# Altium schematic sheet ArduinoZeroV4.0_0.SchDoc: ArduinoZeroV4.0
size 409 x 289 mm; Origin: Eagle; Date: 2023-03-06 22:00:55; SheetNumber: 1; CODE-ARDUINO: DNP; DATASHEET: DNP; DISTRIBUTOR-LINK: DNP; DISTRIBUTOR-PN: DNP; MANUFACTURER: DNP; MANUFACTURER-PN: DNP; NOTE: DNP; Value: DNP; GateName_1: G$1; SymbolName_1: A3L-LOC; LibraryName: Arduino-utility; DeviceSetName: A3-FRAME; Sheet: Sheet:; ReferenceDesignsAREPROVIDED"ASIS"AND"WITHALLFAULTS.ArduinoSADISCLAIMSALLOTHERWARRANTIES,EXPRESSORIMPLIED,
REGARDINGPRODUCTS,INCLUDINGBUTNOTLIMITEDTO,ANYIMPLIEDWARRANTIESOFMERCHANTABILITYORFITNESSFORAPARTICULARPURPOSE

ArduinoSAmaymakechangestospecificationsandproductdescriptionsatanytime,withoutnotice.TheCustomermustnot
relyontheabsenceorcharacteristicsofanyfeaturesorinstructionsmarked"reserved"or"undefined."ArduinoSAreserves
theseforfuturedefinitionandshallhavenoresponsibilitywhatsoeverforconflictsorincompatibilitiesarisingfromfuturechangestothem.
TheproductinformationontheWebSiteorMaterialsissubjecttochangewithoutnotice.Donotfinalizeadesignwiththisinfo

ARDUINOandotherArduinobrandsandlogosandTrademarksofArduinoSA.AllArduinoSATrademarkscannotbeusedwithoutowner'sformalpermission: Reference Designs ARE PROVIDED "AS IS" AND "WITH ALL FAULTS. Arduino SA DISCLAIMS ALL OTHER WARRANTIES, EXPRESS OR IMPLIED, / REGARDING PRODUCTS, INCLUDING BUT NOT LIMITED TO, ANY IMPLIED WARRANTIES OF MERCHANTABILITY OR FITNESS FOR A PARTICULAR PURPOSE / Arduino SA may make changes to specifications and product descriptions at any time, without notice. The Customer must not / rely on the absence or characteristics of any features or instructions marked "reserved" or "undefined." Arduino SA reserves / these for future definition and shall have no responsibility whatsoever for conflicts or incompatibilities arising from future changes to them. / The product information on the Web Site or Materials is subject to change without notice. Do not finalize a design with this info / ARDUINO and other Arduino brands and logos and Trademarks of Arduino SA. All Arduino SA Trademarks cannot be used without owner's formal permission
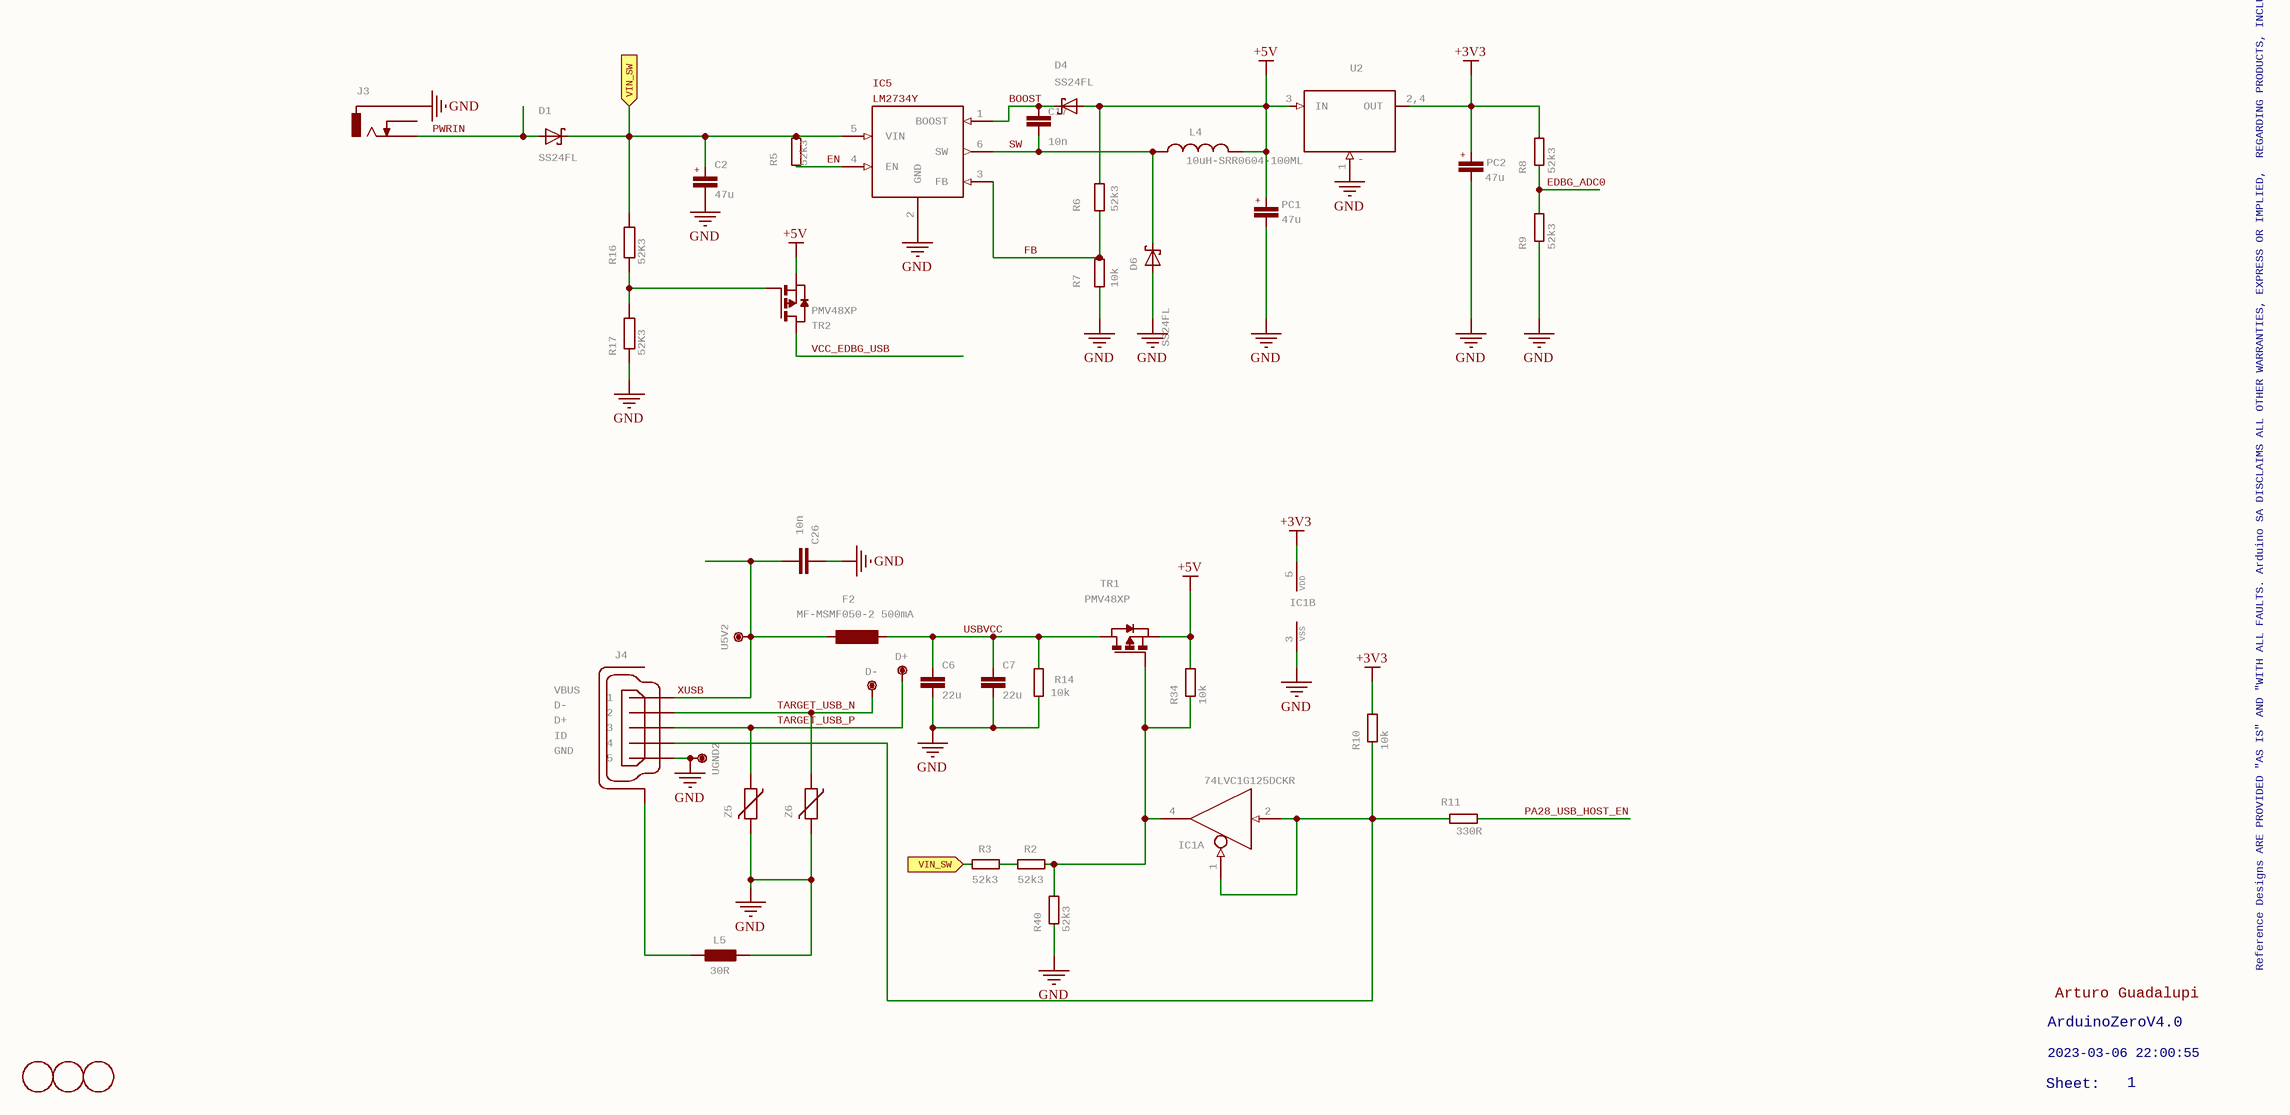
[diagram p0: ArduinoZeroV4.0_0.SchDoc]

## Parts
C2  47u  [PANASONIC_D]
C6  22u  [0805-R2013X50N]
C7  22u  [0805-R2013X50N]
C17  10n  [0603-1608X90N]
C26  10n  [C0603-ROUND]
D1  SS24FL  [SOD123F]
D4  SS24FL  [SOD123F]
D6  SS24FL  [SOD123F]
D+  DNP  [TP-1.00MM]  (value not drawn)
D-  DNP  [TP-1.00MM]  (value not drawn)
F2  MF-MSMF050-2 500mA  [L1812]
FD1  DNP  [FD-1-1.5]  (value not drawn)
FD2  DNP  [FD-1-1.5]  (value not drawn)
FD3  DNP  [FD-1-1.5]  (value not drawn)
IC1  74LVC1G125DCKR  [SC70-5]  (parts A,B of 2)
IC5  LM2734Y  [SOT23-6]
J3  -  [POWERSUPPLY_DC-21MM]  (value not drawn)
J4  -  [ZX62-AB-5PA]  (value not drawn)
L4  10uH-SRR0604-100ML  [SRR0604]
L5  30R  [0805-R2013X50N]
PC1  47u  [PANASONIC_D]
PC2  47u  [PANASONIC_D]
R2  52k3  [C0603]
R3  52k3  [C0603]
R5  52k3  [C0603]
R6  52k3  [C0603]
R7  10k  [C0603]
R8  52k3  [C0603]
R9  52k3  [C0603]
R10  10k  [C0603]
R11  330R  [C0603]
R14  10k  [C0603]
R16  52K3  [R0603-ROUND]
R17  52K3  [R0603-ROUND]
R34  10k  [C0603]
R40  52k3  [C0603]
TR1  PMV48XP  [SOT-23]
TR2  PMV48XP  [SOT-23]
U2  -  [SOT223]
U5V2  DNP  [TP-1.00MM]  (value not drawn)
UGND2  DNP  [TP-1.00MM]  (value not drawn)
Z5  -  [C0603]  (value not drawn)
Z6  -  [C0603]  (value not drawn)

## Ports
VIN_SW (in)

## Nets
+3V3: IC1.5(VDD) PC2.+ R8.2 R10.2 U2.2,4(OUT)
+5V: D4.A L4.P$2 PC1.+ R6.1 R34.2 TR1.2(S) TR2.2(S) U2.3(IN)
GND: C2.- C6.2 C7.2 C26.2 D6.A IC1.3(VSS) IC5.2(GND) J3.-1-3 J4.5 L5.2 PC1.- PC2.- R7.2 R9.1 R14.1 R17.1 R40.1 U2.1(GND/ADJ) UGND2.X(P$1) Z5.2 Z6.2
BOOST: C17.1 D4.C IC5.1(BOOST)
EDBG_ADC0: R8.1 R9.2
EN: IC5.4(EN) R5.2
FB: IC5.3(FB) R6.2 R7.1
PA28_USB_HOST_EN: R11.2
PWRIN: D1.A J3.+1-3
SW: C17.2 D6.C IC5.6(SW) L4.P$1
TARGET_USB_N: D-.X(P$1) J4.2 Z6.1
TARGET_USB_P: D+.X(P$1) J4.3 Z5.1
USBVCC: C6.1 C7.1 F2.1 R14.2 TR1.1(D)
VCC_EDBG_USB: TR2.1(D)
VIN_SW: C2.+ D1.C IC5.5(VIN) R3.1 R5.1 R16.2 ; port VIN_SW
XUSB: C26.1 F2.2 J4.1 U5V2.X(P$1)
NetIC1_1: IC1.1(OE) IC1.2(I) J4.4 R10.1 R11.1
NetIC1_4: IC1.4(O) R2.2 R34.1 R40.2 TR1.3(G)
NetJ4_6-11: J4.6-11(SH) L5.1
NetR2_1: R2.1 R3.2
NetR16_1: R16.1 R17.2 TR2.3(G)

Not connected (* = marked no-connect by the designer): J3 E1-3(2)

## Notes on the sheet
- Reference Designs ARE PROVIDED "AS IS" AND "WITH ALL FAULTS. Arduino SA DISCLAIMS ALL OTHER WARRANTIES, EXPRESS OR IMPLIED,
  REGARDING PRODUCTS, INCLUDING BUT NOT LIMITED TO, ANY IMPLIED WARRANTIES OF MERCHANTABILITY OR FITNESS FOR A PARTICULAR PURPOSE
  Arduino SA may make changes to specifications and product descriptions at any time, without notice. The Customer must not
  rely on the absence or characteristics of any features or instructions marked "reserved" or "undefined." Arduino SA reserves
  these for future definition and shall have no responsibility whatsoever for conflicts or incompatibilities arising from future changes to them.
  The product information on the Web Site or Materials is subject to change without notice. Do not finalize a design with this info
  ARDUINO and other Arduino brands and logos and Trademarks of Arduino SA. All Arduino SA Trademarks cannot be used without owner's formal permission
- ArduinoZeroV4.0
- Arturo Guadalupi
- Sheet:
- 2023-03-06 22:00:55
- 1

## Library data of the parts
C2 PC1 PC2 = C+PAN-D: Polarized Capacitor; MANUFACTURER: Panasonic; MANUFACTURER-PN: EEE-1EA470WP; GateName_1: G$1; SymbolName_1: C+; DeviceName: PAN-D; CODE-ARDUINO: 0113; PN-ALTERNATIVE1: TS13C01E470MET000R; LibraryName: Arduino-rcl; DeviceSetName: C+; +: +; DATASHEET: https://industrial.panasonic.com/cdbs/www-data/pdf/RDE0000/DME0000COL90.pdf; DISTRIBUTOR-LINK: https://www.digikey.com/product-detail/en/panasonic-electronic-components/EEE-1EA470WP/PCE3908CT-ND/766284; DISTRIBUTOR-PN: PCE3908CT-ND
C6 C7 = C-0805: SMD Capacitor; MANUFACTURER: Samsung; MANUFACTURER-PN: CL21A226MQCLQNC; GateName_1: G$1; SymbolName_1: C; DeviceName: -0805; CODE-ARDUINO: 2233; LibraryName: Arduino-rcl; DeviceSetName: C; DATASHEET: https://media.digikey.com/pdf/Data%20Sheets/Samsung%20PDFs/CL21A226MQCLQNC_character.pdf; DISTRIBUTOR-LINK: https://www.digikey.com/product-detail/en/samsung-electro-mechanics-america-inc/CL21A226MQCLQNC/1276-2412-1-ND/3890498; DISTRIBUTOR-PN: 1276-2412-1-ND; NOTE: -
C17 = C-0603: SMD Capacitor; MANUFACTURER: Murata; MANUFACTURER-PN: GRM188R71H103KA01D; GateName_1: G$1; SymbolName_1: C; DeviceName: -0603; CODE-ARDUINO: 0142; LibraryName: Arduino-rcl; DeviceSetName: C; DATASHEET: http://www.murata.com/~/media/webrenewal/support/library/catalog/products/capacitor/mlcc/c02e.pdf; DISTRIBUTOR-LINK: https://www.digikey.com/product-detail/en/murata-electronics-north-america/GRM188R71H103KA01D/490-1512-1-ND/587862; DISTRIBUTOR-PN: 490-1512-1-ND; NOTE: -; PN-ALTERNATIVE1: PN-ALTERNATIVE1; PN-ALTERNATIVE2: PN-ALTERNATIVE2; PN-ALTERNATIVE3: PN-ALTERNATIVE3; PN-ALTERNATIVE4: PN-ALTERNATIVE4; PN-ALTERNATIVE5: PN-ALTERNATIVE5
C26 = 0142_10NF_0603: 10nF 0603; GateName_1: G$1; SymbolName_1: C-EU; MONTHLY_USAGE: _____; TYPE: Condensatori; LibraryName: Condensatori; DeviceSetName: 0142_10NF_0603; CASE: 0603; PART_NUMBER: 10nF_0603; PRICE: _____; SUPPLIER: _____
D1 D4 D6 = SS24FL: Schottky diode; MANUFACTURER: Fairchild; GateName_1: G$1; SymbolName_1: SCHOTTKY-1; CODE-ARDUINO: 0025; LibraryName: Arduino-diodes; DeviceSetName: SS24FL; DATASHEET: https://www.fairchildsemi.com/datasheets/SS/SS24FL.pdf; DISTRIBUTOR-LINK: https://www.digikey.com/product-detail/en/fairchild-on-semiconductor/SS24FL/SS24FLCT-ND/5305093; DISTRIBUTOR-PN: SS24FLCT-ND; MANUFACTURER-PN: SS24FL
D+ D- U5V2 UGND2 = TPTP-1.00MM: Testpoint; GateName_1: G$1; DeviceSetName: TP; SymbolName_1: TESTPOINT; DeviceName: TP-1.00MM; LibraryName: Arduino-utility; CODE-ARDUINO: DNP; DATASHEET: DNP; DISTRIBUTOR-LINK: DNP; DISTRIBUTOR-PN: DNP; MANUFACTURER: DNP; MANUFACTURER-PN: DNP
F2 = 0002_MF-MSMF050-2: 500 mA Multifuse ï¿½ Polyfuse; GateName_1: G$1; SymbolName_1: L-EU; MONTHLY_USAGE: _____; TYPE: Protezione; LibraryName: Protezione; DeviceSetName: 0002_MF-MSMF050-2; CASE: CASE; PART_NUMBER: MF-MSMF050-2; PRICE: _____; SUPPLIER: _____
FD1-FD3 = FIDUCIAL-1.5MM: Fiducial mount; GateName_1: G$1; SymbolName_1: ARDUINO_FIDUCIAL; DeviceName: -1.5MM; LibraryName: Arduino-utility; DeviceSetName: FIDUCIAL; CODE-ARDUINO: DNP; DATASHEET: DNP; DISTRIBUTOR-LINK: DNP; DISTRIBUTOR-PN: DNP; MANUFACTURER: DNP; MANUFACTURER-PN: DNP
IC1 = SN74LVC1G125DCKR: Single bus buffer with 3-state output; MANUFACTURER: Texas Instruments; GateName_1: A; SymbolName_1: 74125; GateName_2: P; SymbolName_2: PWRN-2; CODE-ARDUINO: 0040; NOTE: NO; LibraryName: Arduino-ICs; DeviceSetName: SN74LVC1G125DCKR; DATASHEET: http://www.ti.com/lit/ds/symlink/sn74lvc1g125.pdf; DISTRIBUTOR-LINK: https://www.digikey.com/product-detail/en/texas-instruments/SN74LVC1G125DCKR/296-11604-1-ND/385743; DISTRIBUTOR-PN: 296-11604-1-ND; MANUFACTURER-PN: SN74LVC1G125DCKR
IC5 = 0179_LM2734YMK: 1A Load Step-Down DC-DC Regulator - LM2734Y   Switching; GateName_1: G$1; SymbolName_1: LM2736; MONTHLY_USAGE: _____; LibraryName: Circuito Integrato; DeviceSetName: 0179_LM2734YMK; CASE: SOT23-5; PART_NUMBER: LM2734YMK; PRICE: _____; SUPPLIER: _____; TYPE: Circuito_Integrato
J3 = BARRELLG: Power Barrel Connector Jack 2.10mm ID (0.083"), 5.50mm OD (0.217") Through Hole, Right Angle; MANUFACTURER: Kobiconn; MANUFACTURER-PN: 163-179PH-EX; GateName_1: G$1; SymbolName_1: DC-JACK-SWITCH; DeviceName: LG; CODE-ARDUINO: 0018; LibraryName: Arduino-connectors; DeviceSetName: BARREL; DATASHEET: http://www.mouser.com/ds/2/253/KC-301287-195995.pdf; DISTRIBUTOR-LINK: https://www.mouser.it/ProductDetail/Kobiconn/163-179PH-EX/?qs=Xb8IjHhkxj5l2UOaIqcGCw==; DISTRIBUTOR-PN: 163-179PH-EX
J4 = USB-MICRO: USB - micro AB USB 2.0 Receptacle Connector 5 Position Surface Mount, Right Angle, Horizontal; MANUFACTURER: Hirose; MANUFACTURER-PN: ZX62-AB-5PA(31); GateName_1: G$1; CODE-ARDUINO: 2219; SymbolName_1: USB-MICRO; LibraryName: Arduino-connectors; DeviceSetName: USB-MICRO; VBUS: VBUS; D-: D-; D+: D+; ID: ID; GND: GND; DATASHEET: https://www.hirose.com/product/en/download_file/key_name/ZX/category/Catalog/doc_file_id/31704/?file_category_id=4&item_id=13&is_series=1; DISTRIBUTOR-LINK: http://www.digikey.com/product-detail/en/hirose-electric-co-ltd/ZX62-AB-5PA(31)/H125279CT-ND/5994741; DISTRIBUTOR-PN: H125279CT-ND
L4 = 0031_SRR0604-100ML: SRR0604-100ML; GateName_1: G$1; SymbolName_1: L-US; MONTHLY_USAGE: _____; TYPE: Induttanze; LibraryName: Induttanze; DeviceSetName: 0031_SRR0604-100ML; CASE: SMD_6,5x6,5; PART_NUMBER: SRR0604-100ML; PRICE: _____; SUPPLIER: _____
L5 = FERRITE0805: SMD ferrite; MANUFACTURER: Samsung; MANUFACTURER-PN: CIB21P300NE; GateName_1: >NAME; DeviceName: 0805; CODE-ARDUINO: 0001; SymbolName_1: FERRITE; LibraryName: Arduino-rcl; DeviceSetName: FERRITE; DATASHEET: https://media.digikey.com/pdf/Data%20Sheets/Samsung%20PDFs/Chip_Inductor_Catalog_2014.pdf; DISTRIBUTOR-LINK: https://www.digikey.com/products/en?keywords=CIB21P300NE; DISTRIBUTOR-PN: CIB21P300NE-ND; PN-ALTERNATIVE1: PN-ALTERNATIVE1
R2 R3 R5-R9 R40 = R-0603: SMD Resistor; MANUFACTURER: Yageo; MANUFACTURER-PN: RC0603FR-0752K3L; GateName_1: G$1; SymbolName_1: R; DeviceName: -0603; CODE-ARDUINO: A5459; NOTE: 1% ONLY; LibraryName: Arduino-rcl; DeviceSetName: R; DATASHEET: https://industrial.panasonic.com/cdbs/www-data/pdf/RDA0000/AOA0000C304.pdf; DISTRIBUTOR-LINK: https://www.digikey.com/product-detail/en/yageo/RC0603FR-0752K3L/311-52.3KHRCT-ND/730237; DISTRIBUTOR-PN: 311-52.3KHRCT-ND; PN-ALTERNATIVE1: -
R10 R14 R34 = R-0603: SMD Resistor; MANUFACTURER: Yageo; MANUFACTURER-PN: RC0603JR-0710KL; GateName_1: G$1; SymbolName_1: R; DeviceName: -0603; CODE-ARDUINO: 0028; NOTE: NO; LibraryName: Arduino-rcl; DeviceSetName: R; DATASHEET: http://www.yageo.com/documents/recent/PYu-RC_Group_51_RoHS_L_8.pdf; DISTRIBUTOR-LINK: https://www.digikey.com/product-detail/en/yageo/RC0603JR-0710KL/311-10KGRCT-ND/729647; DISTRIBUTOR-PN: 311-10KGRCT-ND; PN-ALTERNATIVE1: -
R11 = R-0603: SMD Resistor; MANUFACTURER: Yageo; MANUFACTURER-PN: RC0603FR-07330RL; GateName_1: G$1; SymbolName_1: R; DeviceName: -0603; CODE-ARDUINO: 0049; NOTE: NO; LibraryName: Arduino-rcl; DeviceSetName: R; DATASHEET: http://www.yageo.com/documents/recent/PYu-RC_Group_51_RoHS_L_10.pdf; DISTRIBUTOR-LINK: https://www.digikey.com/product-detail/en/yageo/RC0603FR-07330RL/311-330HRCT-ND/730109; DISTRIBUTOR-PN: 311-330HRCT-ND; PN-ALTERNATIVE1: -
R16 R17 = 0180_52K3_0603: 52k3 0603; GateName_1: G$1; SymbolName_1: R-EU; MONTHLY_USAGE: _____; LibraryName: Resistenze; DeviceSetName: 0180_52K3_0603; CASE: 0603; PART_NUMBER: 52k3_0603; PRICE: _____; SUPPLIER: _____; TYPE: Resistenze
TR1 TR2 = PMV48XP: 20 V, 3.5 A P-channel Trench MOSFET - PMV48XP; MANUFACTURER: Nexperia; MANUFACTURER-PN: PMV48XP,215; SymbolName_1: P_MOSFET; CODE-ARDUINO: 1039; PN-ALTERNATIVE: FDN340P; PN-ALTERNATIVE2: IRLML6402TRPBF; GateName_1: A; LibraryName: Arduino-transistors; DeviceSetName: PMV48XP; DATASHEET: https://assets.nexperia.com/documents/data-sheet/PMV48XP.pdf; DISTRIBUTOR-LINK: https://www.digikey.com/product-detail/en/nexperia-usa-inc/PMV48XP215/1727-5907-1-ND/2744665; DISTRIBUTOR-PN: 1727-5907-1-ND
U2 = LDOSOT223: LDO; MANUFACTURER: NXP; MANUFACTURER-PN: NX1117CE33Z,115; GateName_1: G$1; SymbolName_1: LINEAR_3PINS; CODE-ARDUINO: 0045; NOTE: NO; DeviceName: SOT223; LibraryName: Arduino-ICs; DeviceSetName: LDO; DATASHEET: https://media.digikey.com/pdf/Data%20Sheets/NXP%20PDFs/NX1117C(E).pdf; DISTRIBUTOR-LINK: https://www.digikey.com/product-detail/en/nxp-usa-inc/NX1117CE33Z,115/568-8443-1-ND/2765160; DISTRIBUTOR-PN: 568-8443-1-ND
Z5 Z6 = VARISTOR: Varistors; MANUFACTURER: Bourns; GateName_1: A; CODE-ARDUINO: 0010; CODE-TK2: CG0603MLC-05E; NOTE: NO; SymbolName_1: VARISTOR; LibraryName: Arduino-rcl; DeviceSetName: VARISTOR; DATASHEET: http://www.bourns.com/data/global/pdfs/MLC.pdf; DISTRIBUTOR-LINK: https://www.digikey.com/product-detail/it/bourns-inc/CG0603MLC-05E/CG0603MLC-05ECT-ND/3438061; DISTRIBUTOR-PN: CG0603MLC-05ETR-ND; MANUFACTURER-PN: CG0603MLC-05E